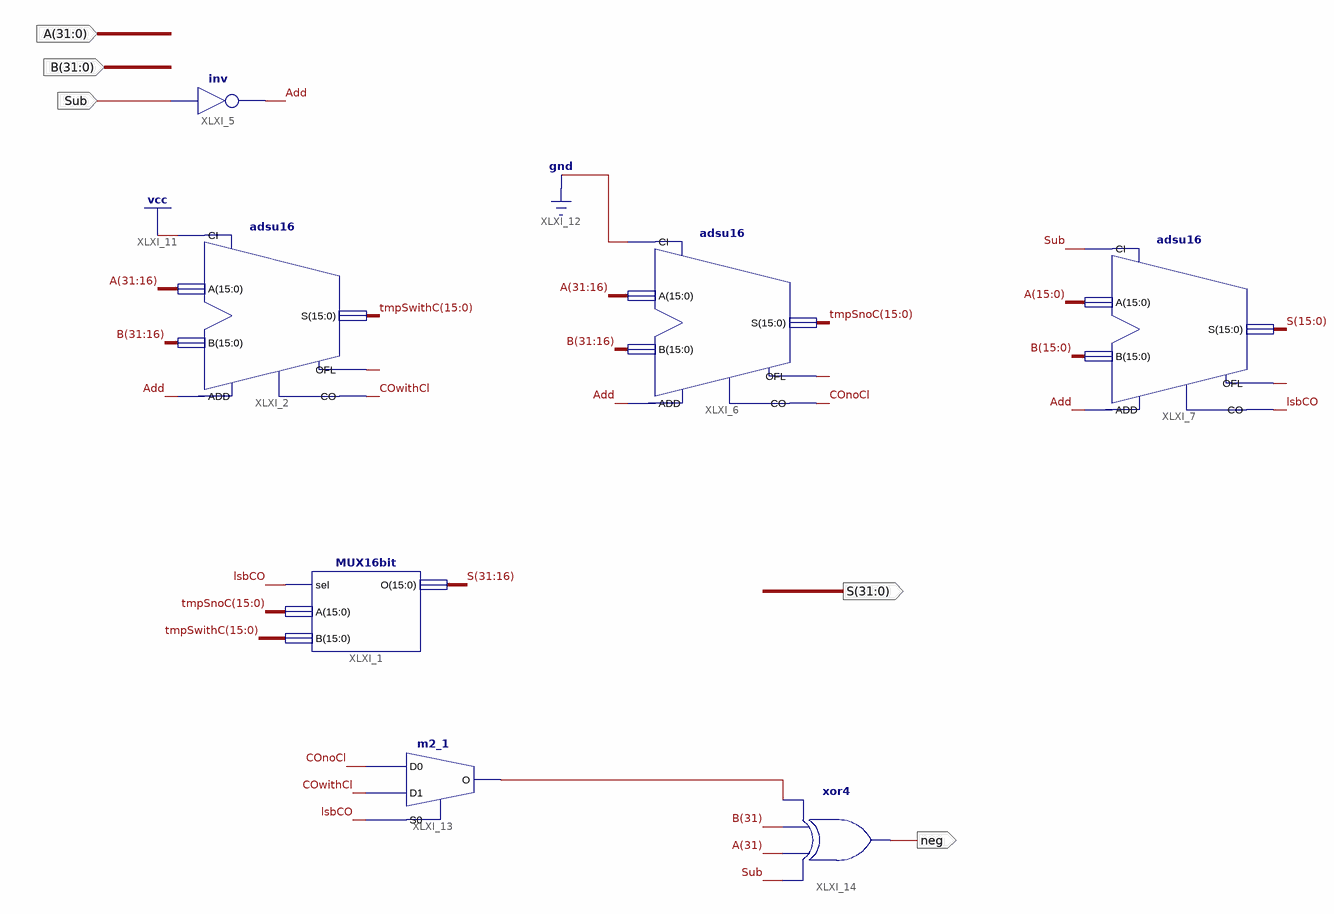
[diagram p0: schematic sheet 1]
// Xilinx ISE schematic DLX_ADD_SUB.sch (spartan6) as structural Verilog: 7 symbols, 5 ports
module DLX_ADD_SUB (
  input  [31:0] A,
  input  [31:0] B,
  input  Sub,
  output neg,
  output [31:0] S
);

  wire Add, COnoCl, COwithCl, lsbCO, XLXN_10, XLXN_17, XLXN_24, XLXN_54;
  wire [15:0] tmpSnoC, tmpSwithC;

  MUX16bit XLXI_1 (.sel(lsbCO), .A(tmpSnoC), .B(tmpSwithC), .O(S[31:16]));
  not XLXI_5 (Add, Sub);
  adsu16 XLXI_7 (.A(A[15:0]), .ADD(Add), .B(B[15:0]), .CI(Sub), .CO(lsbCO), .OFL(XLXN_24), .S(S[15:0]));
  adsu16 XLXI_2 (.A(A[31:16]), .ADD(Add), .B(B[31:16]), .CI(1'b1), .CO(COwithCl), .OFL(XLXN_10), .S(tmpSwithC));
  adsu16 XLXI_6 (.A(A[31:16]), .ADD(Add), .B(B[31:16]), .CI(1'b0), .CO(COnoCl), .OFL(XLXN_17), .S(tmpSnoC));
  m2_1 XLXI_13 (.D0(COnoCl), .D1(COwithCl), .S0(lsbCO), .O(XLXN_54));
  xor XLXI_14 (neg, Sub, A[31], B[31], XLXN_54);
endmodule
